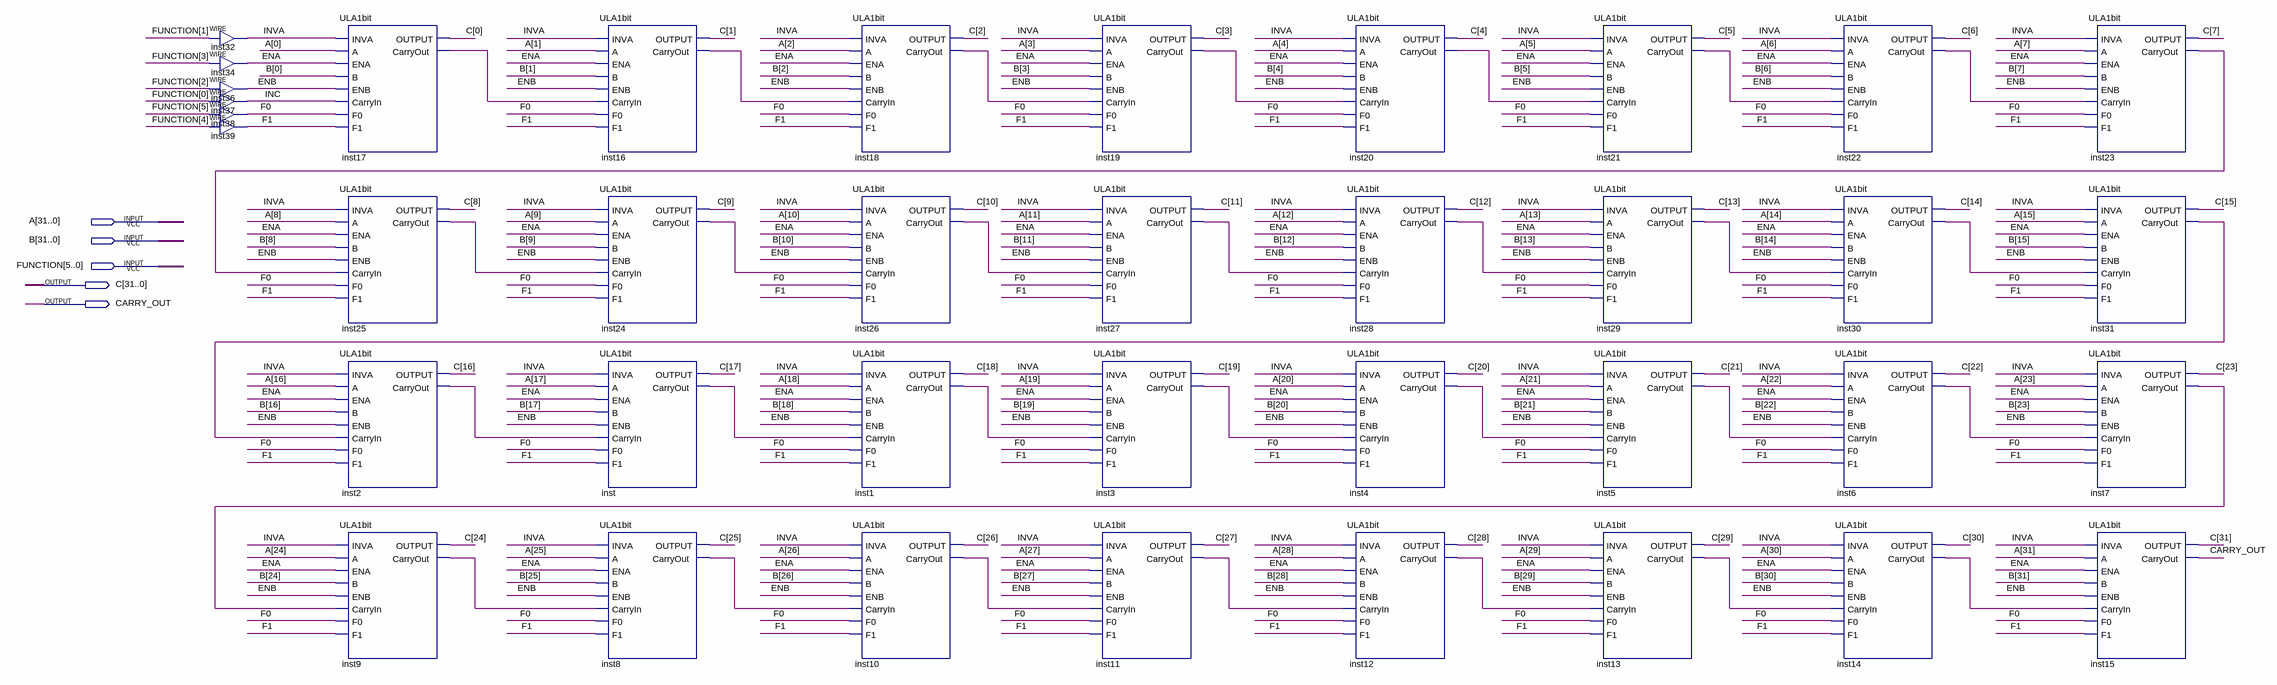
[diagram p0: schematic sheet]
// Quartus schematic ULA32bits.bdf as structural Verilog: 38 symbols, 5 pins
module ULA32bits (
  input  [31:0] A,
  input  [31:0] B,
  input  [5:0] FUNCTION,
  output [31:0] C,
  output CARRY_OUT
);

  wire ENA, ENB, F0, F1, INC, inst1_carryout, inst2_carryout, inst3_carryout, inst4_carryout, inst5_carryout,
       inst6_carryout, inst7_carryout, inst8_carryout, inst9_carryout, inst10_carryout, inst11_carryout,
       inst12_carryout, inst13_carryout, inst14_carryout, inst16_carryout, inst17_carryout, inst18_carryout,
       inst19_carryout, inst20_carryout, inst21_carryout, inst22_carryout, inst23_carryout, inst24_carryout,
       inst25_carryout, inst26_carryout, inst27_carryout, inst28_carryout, inst29_carryout, inst30_carryout,
       inst31_carryout, inst_carryout, INVA;

  assign INVA = FUNCTION[1];  // WIRE inst32
  assign ENA = FUNCTION[3];  // WIRE inst34
  assign ENB = FUNCTION[2];  // WIRE inst36
  assign INC = FUNCTION[0];  // WIRE inst37
  assign F0 = FUNCTION[5];  // WIRE inst38
  assign F1 = FUNCTION[4];  // WIRE inst39
  ULA1bit inst17 (
    .INVA(INVA), .A(A[0]), .ENA(ENA), .B(B[0]), .ENB(ENB), .CarryIn(INC), .F0(F0), .F1(F1), .OUTPUT(C[0]),
    .CarryOut(inst17_carryout));
  ULA1bit inst25 (
    .INVA(INVA), .A(A[8]), .ENA(ENA), .B(B[8]), .ENB(ENB), .CarryIn(inst23_carryout), .F0(F0), .F1(F1),
    .OUTPUT(C[8]), .CarryOut(inst25_carryout));
  ULA1bit inst2 (
    .INVA(INVA), .A(A[16]), .ENA(ENA), .B(B[16]), .ENB(ENB), .CarryIn(inst31_carryout), .F0(F0), .F1(F1),
    .OUTPUT(C[16]), .CarryOut(inst2_carryout));
  ULA1bit inst9 (
    .INVA(INVA), .A(A[24]), .ENA(ENA), .B(B[24]), .ENB(ENB), .CarryIn(inst7_carryout), .F0(F0), .F1(F1),
    .OUTPUT(C[24]), .CarryOut(inst9_carryout));
  ULA1bit inst16 (
    .INVA(INVA), .A(A[1]), .ENA(ENA), .B(B[1]), .ENB(ENB), .CarryIn(inst17_carryout), .F0(F0), .F1(F1),
    .OUTPUT(C[1]), .CarryOut(inst16_carryout));
  ULA1bit inst24 (
    .INVA(INVA), .A(A[9]), .ENA(ENA), .B(B[9]), .ENB(ENB), .CarryIn(inst25_carryout), .F0(F0), .F1(F1),
    .OUTPUT(C[9]), .CarryOut(inst24_carryout));
  ULA1bit inst (
    .INVA(INVA), .A(A[17]), .ENA(ENA), .B(B[17]), .ENB(ENB), .CarryIn(inst2_carryout), .F0(F0), .F1(F1),
    .OUTPUT(C[17]), .CarryOut(inst_carryout));
  ULA1bit inst8 (
    .INVA(INVA), .A(A[25]), .ENA(ENA), .B(B[25]), .ENB(ENB), .CarryIn(inst9_carryout), .F0(F0), .F1(F1),
    .OUTPUT(C[25]), .CarryOut(inst8_carryout));
  ULA1bit inst18 (
    .INVA(INVA), .A(A[2]), .ENA(ENA), .B(B[2]), .ENB(ENB), .CarryIn(inst16_carryout), .F0(F0), .F1(F1),
    .OUTPUT(C[2]), .CarryOut(inst18_carryout));
  ULA1bit inst26 (
    .INVA(INVA), .A(A[10]), .ENA(ENA), .B(B[10]), .ENB(ENB), .CarryIn(inst24_carryout), .F0(F0), .F1(F1),
    .OUTPUT(C[10]), .CarryOut(inst26_carryout));
  ULA1bit inst1 (
    .INVA(INVA), .A(A[18]), .ENA(ENA), .B(B[18]), .ENB(ENB), .CarryIn(inst_carryout), .F0(F0), .F1(F1),
    .OUTPUT(C[18]), .CarryOut(inst1_carryout));
  ULA1bit inst10 (
    .INVA(INVA), .A(A[26]), .ENA(ENA), .B(B[26]), .ENB(ENB), .CarryIn(inst8_carryout), .F0(F0), .F1(F1),
    .OUTPUT(C[26]), .CarryOut(inst10_carryout));
  ULA1bit inst19 (
    .INVA(INVA), .A(A[3]), .ENA(ENA), .B(B[3]), .ENB(ENB), .CarryIn(inst18_carryout), .F0(F0), .F1(F1),
    .OUTPUT(C[3]), .CarryOut(inst19_carryout));
  ULA1bit inst27 (
    .INVA(INVA), .A(A[11]), .ENA(ENA), .B(B[11]), .ENB(ENB), .CarryIn(inst26_carryout), .F0(F0), .F1(F1),
    .OUTPUT(C[11]), .CarryOut(inst27_carryout));
  ULA1bit inst3 (
    .INVA(INVA), .A(A[19]), .ENA(ENA), .B(B[19]), .ENB(ENB), .CarryIn(inst1_carryout), .F0(F0), .F1(F1),
    .OUTPUT(C[19]), .CarryOut(inst3_carryout));
  ULA1bit inst11 (
    .INVA(INVA), .A(A[27]), .ENA(ENA), .B(B[27]), .ENB(ENB), .CarryIn(inst10_carryout), .F0(F0), .F1(F1),
    .OUTPUT(C[27]), .CarryOut(inst11_carryout));
  ULA1bit inst20 (
    .INVA(INVA), .A(A[4]), .ENA(ENA), .B(B[4]), .ENB(ENB), .CarryIn(inst19_carryout), .F0(F0), .F1(F1),
    .OUTPUT(C[4]), .CarryOut(inst20_carryout));
  ULA1bit inst28 (
    .INVA(INVA), .A(A[12]), .ENA(ENA), .B(B[12]), .ENB(ENB), .CarryIn(inst27_carryout), .F0(F0), .F1(F1),
    .OUTPUT(C[12]), .CarryOut(inst28_carryout));
  ULA1bit inst4 (
    .INVA(INVA), .A(A[20]), .ENA(ENA), .B(B[20]), .ENB(ENB), .CarryIn(inst3_carryout), .F0(F0), .F1(F1),
    .OUTPUT(C[20]), .CarryOut(inst4_carryout));
  ULA1bit inst12 (
    .INVA(INVA), .A(A[28]), .ENA(ENA), .B(B[28]), .ENB(ENB), .CarryIn(inst11_carryout), .F0(F0), .F1(F1),
    .OUTPUT(C[28]), .CarryOut(inst12_carryout));
  ULA1bit inst21 (
    .INVA(INVA), .A(A[5]), .ENA(ENA), .B(B[5]), .ENB(ENB), .CarryIn(inst20_carryout), .F0(F0), .F1(F1),
    .OUTPUT(C[5]), .CarryOut(inst21_carryout));
  ULA1bit inst29 (
    .INVA(INVA), .A(A[13]), .ENA(ENA), .B(B[13]), .ENB(ENB), .CarryIn(inst28_carryout), .F0(F0), .F1(F1),
    .OUTPUT(C[13]), .CarryOut(inst29_carryout));
  ULA1bit inst5 (
    .INVA(INVA), .A(A[21]), .ENA(ENA), .B(B[21]), .ENB(ENB), .CarryIn(inst4_carryout), .F0(F0), .F1(F1),
    .OUTPUT(C[21]), .CarryOut(inst5_carryout));
  ULA1bit inst13 (
    .INVA(INVA), .A(A[29]), .ENA(ENA), .B(B[29]), .ENB(ENB), .CarryIn(inst12_carryout), .F0(F0), .F1(F1),
    .OUTPUT(C[29]), .CarryOut(inst13_carryout));
  ULA1bit inst22 (
    .INVA(INVA), .A(A[6]), .ENA(ENA), .B(B[6]), .ENB(ENB), .CarryIn(inst21_carryout), .F0(F0), .F1(F1),
    .OUTPUT(C[6]), .CarryOut(inst22_carryout));
  ULA1bit inst30 (
    .INVA(INVA), .A(A[14]), .ENA(ENA), .B(B[14]), .ENB(ENB), .CarryIn(inst29_carryout), .F0(F0), .F1(F1),
    .OUTPUT(C[14]), .CarryOut(inst30_carryout));
  ULA1bit inst6 (
    .INVA(INVA), .A(A[22]), .ENA(ENA), .B(B[22]), .ENB(ENB), .CarryIn(inst5_carryout), .F0(F0), .F1(F1),
    .OUTPUT(C[22]), .CarryOut(inst6_carryout));
  ULA1bit inst14 (
    .INVA(INVA), .A(A[30]), .ENA(ENA), .B(B[30]), .ENB(ENB), .CarryIn(inst13_carryout), .F0(F0), .F1(F1),
    .OUTPUT(C[30]), .CarryOut(inst14_carryout));
  ULA1bit inst23 (
    .INVA(INVA), .A(A[7]), .ENA(ENA), .B(B[7]), .ENB(ENB), .CarryIn(inst22_carryout), .F0(F0), .F1(F1),
    .OUTPUT(C[7]), .CarryOut(inst23_carryout));
  ULA1bit inst31 (
    .INVA(INVA), .A(A[15]), .ENA(ENA), .B(B[15]), .ENB(ENB), .CarryIn(inst30_carryout), .F0(F0), .F1(F1),
    .OUTPUT(C[15]), .CarryOut(inst31_carryout));
  ULA1bit inst7 (
    .INVA(INVA), .A(A[23]), .ENA(ENA), .B(B[23]), .ENB(ENB), .CarryIn(inst6_carryout), .F0(F0), .F1(F1),
    .OUTPUT(C[23]), .CarryOut(inst7_carryout));
  ULA1bit inst15 (
    .INVA(INVA), .A(A[31]), .ENA(ENA), .B(B[31]), .ENB(ENB), .CarryIn(inst14_carryout), .F0(F0), .F1(F1),
    .OUTPUT(C[31]), .CarryOut(CARRY_OUT));
endmodule
